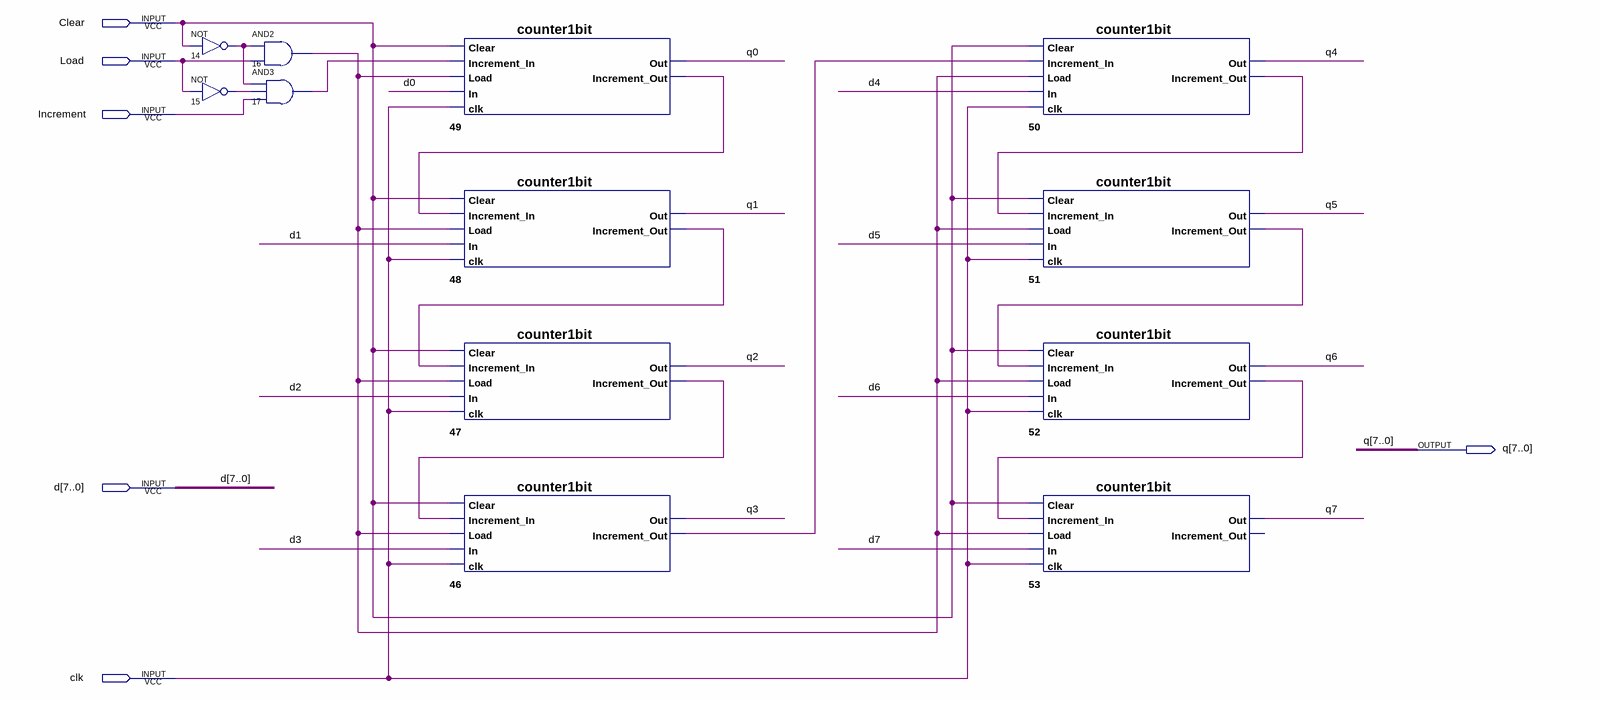
[diagram p0: schematic sheet]
// Quartus schematic counter8bits.bdf as structural Verilog: 12 symbols, 6 pins
module counter8bits (
  input  Clear,
  input  Load,
  input  Increment,
  input  [7:0] d,
  input  clk,
  output [7:0] q
);

  wire n14_out, n15_out, n16_out, n17_out, n46_increment_out, n47_increment_out, n48_increment_out,
       n49_increment_out, n50_increment_out, n51_increment_out, n52_increment_out;

  not u_14 (n14_out, Clear);
  not u_15 (n15_out, Load);
  and u_16 (n16_out, n14_out, Load);
  and u_17 (n17_out, n14_out, n15_out, Increment);
  counter1bit u_49 (
    .Clear(Clear), .Increment_In(n17_out), .Load(n16_out), .In(d[0]), .clk(clk), .Out(q[0]),
    .Increment_Out(n49_increment_out));
  counter1bit u_48 (
    .Clear(Clear), .Increment_In(n49_increment_out), .Load(n16_out), .In(d[1]), .clk(clk), .Out(q[1]),
    .Increment_Out(n48_increment_out));
  counter1bit u_47 (
    .Clear(Clear), .Increment_In(n48_increment_out), .Load(n16_out), .In(d[2]), .clk(clk), .Out(q[2]),
    .Increment_Out(n47_increment_out));
  counter1bit u_46 (
    .Clear(Clear), .Increment_In(n47_increment_out), .Load(n16_out), .In(d[3]), .clk(clk), .Out(q[3]),
    .Increment_Out(n46_increment_out));
  counter1bit u_50 (
    .Clear(Clear), .Increment_In(n46_increment_out), .Load(n16_out), .In(d[4]), .clk(clk), .Out(q[4]),
    .Increment_Out(n50_increment_out));
  counter1bit u_51 (
    .Clear(Clear), .Increment_In(n50_increment_out), .Load(n16_out), .In(d[5]), .clk(clk), .Out(q[5]),
    .Increment_Out(n51_increment_out));
  counter1bit u_52 (
    .Clear(Clear), .Increment_In(n51_increment_out), .Load(n16_out), .In(d[6]), .clk(clk), .Out(q[6]),
    .Increment_Out(n52_increment_out));
  counter1bit u_53 (
    .Clear(Clear), .Increment_In(n52_increment_out), .Load(n16_out), .In(d[7]), .clk(clk), .Out(q[7]));  // open: Increment_Out
endmodule
